# Altium project rtls.PrjPcb
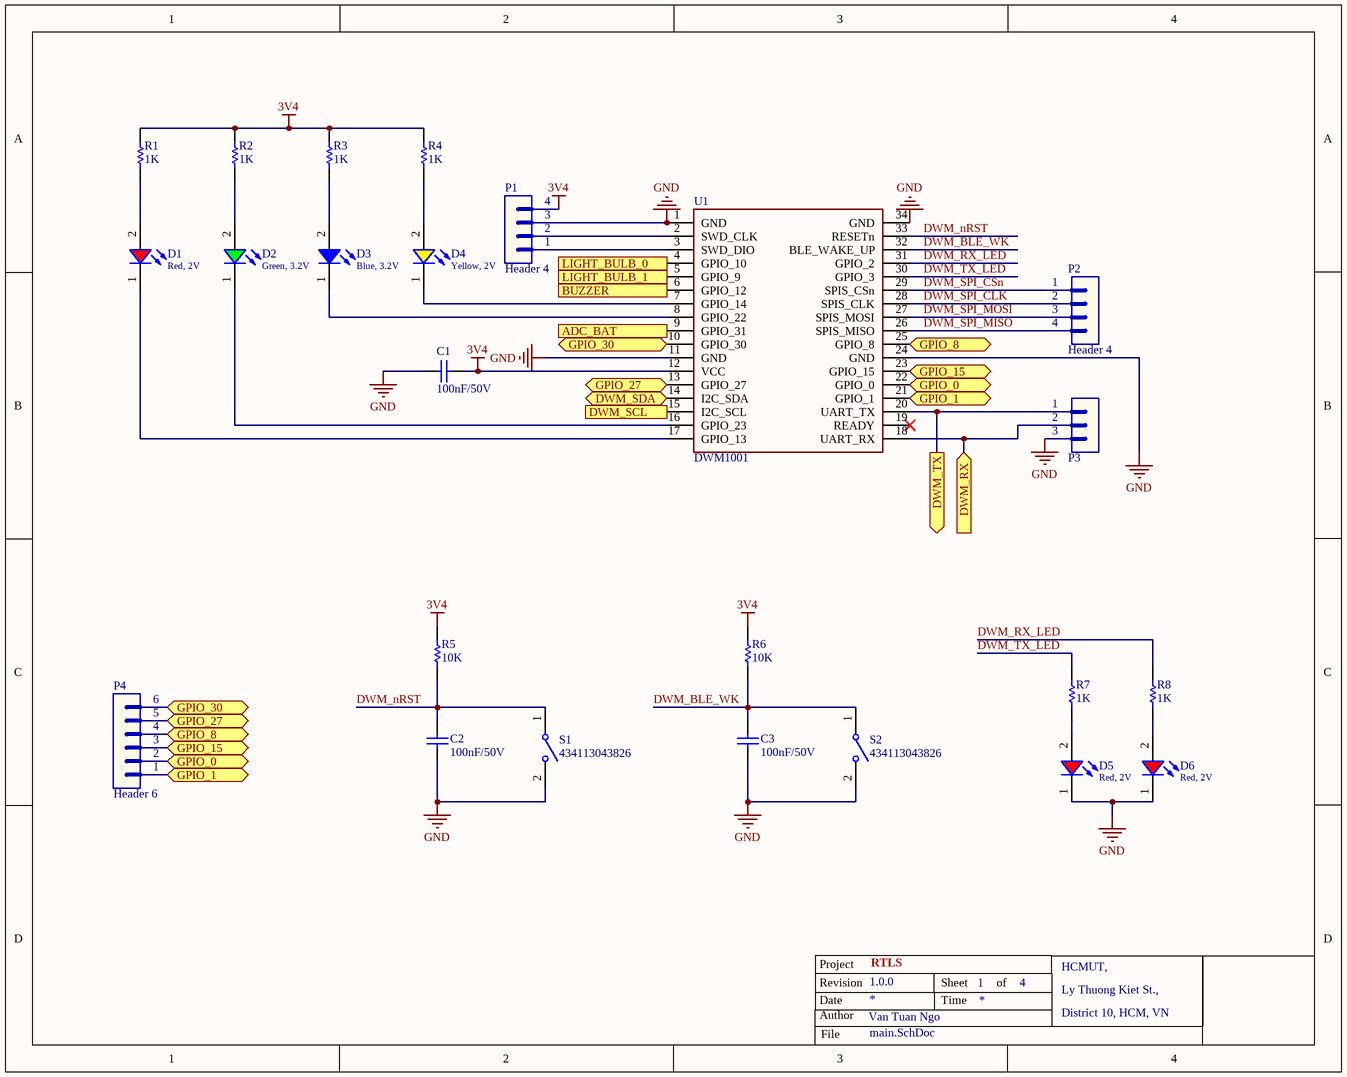
[diagram p0: main.SchDoc]
4 sheets, 76 parts. Net scope: flat (ports and power ports of the same name join across sheets).
Board file: rtls.PcbDoc
Sheets:
  main.SchDoc
  power_supply.SchDoc
  io_sensor.SchDoc
  serial.SchDoc

## Sheet main.SchDoc
size OrCAD A; DrawnBy: Van Tuan Ngo; Organization: PIF Club; Address1: HCMUT,; Address2: Ly Thuong Kiet St.,; Address3: District 10, HCM, VN; DocumentNumber: 1; Revision: 1.0.0; SheetNumber: 1; SheetTotal: 4; Project: RTLS

### Parts
C1  value 100nF/50V  [CAP-SM-0805]  (hidden comment: Cap-100nF-50V-0805)
C2  value 100nF/50V  [CAP-SM-0805]  (hidden comment: Cap-100nF-50V-0805)
C3  value 100nF/50V  [CAP-SM-0805]  (hidden comment: Cap-100nF-50V-0805)
D1  Red, 2V  [WL-SMCW_0805]
D2  Green, 3.2V  [WL-SMCW_0805]
D3  Blue, 3.2V  [WL-SMCW_0805]
D4  Yellow, 2V  [WL-SMCW_0805]
D5  Red, 2V  [WL-SMCW_0805]
D6  Red, 2V  [WL-SMCW_0805]
P1  Header 4  [JP4]
P2  Header 4  [JP4]
P3  Header 3  [JP3]  (value not drawn)
P4  Header 6  [JP6]
R1  value 1K  [RES-SM-0805]  (hidden comment: Res-1K-0805)
R2  value 1K  [RES-SM-0805]  (hidden comment: Res-1K-0805)
R3  value 1K  [RES-SM-0805]  (hidden comment: Res-1K-0805)
R4  value 1K  [RES-SM-0805]  (hidden comment: Res-1K-0805)
R5  value 10K  [RES-SM-0805]  (hidden comment: Res-10k-0805)
R6  value 10K  [RES-SM-0805]  (hidden comment: Res-10k-0805)
R7  value 1K  [RES-SM-0805]  (hidden comment: Res-1K-0805)
R8  value 1K  [RES-SM-0805]  (hidden comment: Res-1K-0805)
S1  434113043826  [434113043826]
S2  434113043826  [434113043826]
U1  DWM1001  [DWM1001]

### Ports
ADC_BAT (in), BUZZER (out), DWM_RX (in), DWM_SCL (out), DWM_SDA (bidir), DWM_TX (out), GPIO_0 (bidir), GPIO_1 (bidir), GPIO_8 (bidir), GPIO_15 (bidir), GPIO_27 (bidir), GPIO_30 (bidir), LIGHT_BULB_0 (out), LIGHT_BULB_1 (out)

### Nets
3V4: C1.2 P1.4 R1.1 R2.1 R3.1 R4.1 R5.2 R6.2 U1.12(VCC)
GND: C1.1 C2.1 C3.1 D5.1(K) D6.1(K) P1.3 P3.3 S1.2 S2.2 U1.1(GND) U1.11(GND) U1.24(GND) U1.34(GND)
DWM_BLE_WK: C3.2 R6.1 S2.1 U1.32(BLE_WAKE_UP)
DWM_nRST: C2.2 R5.1 S1.1 U1.33(RESETn)
DWM_RX_LED: R8.1 U1.31(GPIO_2)
DWM_SCL: U1.15(I2C_SCL) ; port DWM_SCL
DWM_SDA: U1.14(I2C_SDA) ; port DWM_SDA
DWM_SPI_CLK: P2.2 U1.28(SPIS_CLK)
DWM_SPI_CSn: P2.1 U1.29(SPIS_CSn)
DWM_SPI_MISO: P2.4 U1.26(SPIS_MISO)
DWM_SPI_MOSI: P2.3 U1.27(SPIS_MOSI)
DWM_TX_LED: R7.1 U1.30(GPIO_3)
NetD1_1: D1.1(K) U1.17(GPIO_13)
NetD1_2: D1.2(A) R1.2
NetD2_1: D2.1(K) U1.16(GPIO_23)
NetD2_2: D2.2(A) R2.2
NetD3_1: D3.1(K) U1.8(GPIO_22)
NetD3_2: D3.2(A) R3.2
NetD4_1: D4.1(K) U1.7(GPIO_14)
NetD4_2: D4.2(A) R4.2
NetD5_2: D5.2(A) R7.2
NetD6_2: D6.2(A) R8.2
NetP1_1: P1.1 U1.3(SWD_DIO)
NetP1_2: P1.2 U1.2(SWD_CLK)
NetP3_1: P3.1 U1.20(UART_TX) ; port DWM_TX
NetP3_2: P3.2 U1.18(UART_RX) ; port DWM_RX
NetP4_1: P4.1 U1.21(GPIO_1) ; port GPIO_1
NetP4_2: P4.2 U1.22(GPIO_0) ; port GPIO_0
NetP4_3: P4.3 U1.23(GPIO_15) ; port GPIO_15
NetP4_4: P4.4 U1.25(GPIO_8) ; port GPIO_8
NetP4_5: P4.5 U1.13(GPIO_27) ; port GPIO_27
NetP4_6: P4.6 U1.10(GPIO_30) ; port GPIO_30
NetQ1_1: U1.4(GPIO_10) ; port LIGHT_BULB_0
NetQ2_1: U1.5(GPIO_9) ; port LIGHT_BULB_1
NetR17_1: U1.9(GPIO_31) ; port ADC_BAT
NetR21_1: U1.6(GPIO_12) ; port BUZZER

Not connected (* = marked no-connect by the designer): U1 19(READY)*

### Notes on the sheet
- Project
- Revision
- Date
- Author
- Sheet
- Time
- of
- File

### Library data of the parts
C1-C3 = Cap-100nF-50V-0805: CAP CER 0.1UF 50V Y5V 0805; Manufacturer: Samsung Electro-Mechanics; Manufacturer Part Number: CL21F104ZBCNNNC; Local Supplier: thegioiic; Local Supplier Link: https://www.thegioiic.com/products/tu-gom-0805-100nf-0-1uf-50v; Supplier 1: Digikey; Supplier 1 Part Number: 1276-1007-1-ND; Supplier 1 Link: https://www.digikey.com/product-detail/en/samsung-electro-mechanics/CL21F104ZBCNNNC/1276-1007-1-ND/3889093
D1 D5 D6 = 150080RS75000: WL-SMCW SMT Mono-color Chip LED Waterclear, size 0805, Red, 2V, 140deg; Chip Technology: AlInGaP; Dominant Wavelength typ.: 625nm; Luminous Intensity typ.: 150mcd; Peak Wavelength typ.: 630nm; Viewing Angle: 140deg; ComponentLink1Description: Manufacturer; ComponentLink1URL: http://www.we-online.de; ComponentLink2URL: https://www.we-online.com/catalog/datasheet/150080RS75000.pdf; ComponentLink2Description: Datasheet; Forward Voltage typ.: 2V; Emitting Color: Red; Mounting Technology: SMT; Operating Temperature: -40 to +85degC; Published Date: December 2019; Part Number: 150080RS75000; Packaging: Tape and Reel; Size: 0805; Publisher: Wurth Elektronik
D2 = 150080GS75000: WL-SMCW SMT Mono-color Chip LED Waterclear, size 0805, Green, 3.2V, 140deg; Chip Technology: InGaN; Dominant Wavelength typ.: 525nm; Luminous Intensity typ.: 450mcd; Peak Wavelength typ.: 515nm; Viewing Angle: 140deg; ComponentLink1Description: Manufacturer; ComponentLink1URL: http://www.we-online.de; ComponentLink2URL: https://www.we-online.com/catalog/datasheet/150080GS75000.pdf; ComponentLink2Description: Datasheet; Forward Voltage typ.: 3.2V; Emitting Color: Green; Mounting Technology: SMT; Operating Temperature: -40 to +85degC; Published Date: December 2019; Part Number: 150080GS75000; Packaging: Tape and Reel; Size: 0805; Publisher: Wurth Elektronik
D3 = 150080BS75000: WL-SMCW SMT Mono-color Chip LED Waterclear, size 0805, Blue, 3.2V, 140deg; Chip Technology: InGaN; Dominant Wavelength typ.: 470nm; Luminous Intensity typ.: 145mcd; Peak Wavelength typ.: 465nm; Viewing Angle: 140deg; ComponentLink1Description: Manufacturer; ComponentLink1URL: http://www.we-online.de; ComponentLink2URL: https://www.we-online.com/catalog/datasheet/150080BS75000.pdf; ComponentLink2Description: Datasheet; Forward Voltage typ.: 3.2V; Emitting Color: Blue; Mounting Technology: SMT; Operating Temperature: -40 to +85degC; Published Date: December 2019; Part Number: 150080BS75000; Packaging: Tape and Reel; Size: 0805; Publisher: Wurth Elektronik
D4 = 150080YS75000: WL-SMCW SMT Mono-color Chip LED Waterclear, size 0805, Yellow, 2V, 140deg; Chip Technology: AlInGaP; Dominant Wavelength typ.: 590nm; Luminous Intensity typ.: 120mcd; Peak Wavelength typ.: 595nm; Viewing Angle: 140deg; ComponentLink1Description: Manufacturer; ComponentLink1URL: http://www.we-online.de; ComponentLink2URL: https://www.we-online.com/catalog/datasheet/150080YS75000.pdf; ComponentLink2Description: Datasheet; Forward Voltage typ.: 2V; Emitting Color: Yellow; Mounting Technology: SMT; Operating Temperature: -40 to +85degC; Published Date: December 2019; Part Number: 150080YS75000; Packaging: Tape and Reel; Size: 0805; Publisher: Wurth Elektronik
P1 P2 = Header 4: Header, 4-Pin; LatestRevisionDate: 17-Jul-2002; LatestRevisionNote: Re-released for DXP Platform.; Publisher: Altium Limited; Local Supplier: thegioiic; Local Supplier Part Number: x; Local Supplier Link: https://www.thegioiic.com/products/hang-rao-duc-don-2-54mm-40-chan-1-hang-cao-11-4mm-xuyen-lo
P3 = Header 3: Header, 3-Pin; LatestRevisionDate: 17-Jul-2002; LatestRevisionNote: Re-released for DXP Platform.; Publisher: Altium Limited; Local Supplier: thegioiic; Local Supplier Part Number: x; Local Supplier Link: https://www.thegioiic.com/products/hang-rao-duc-don-2-54mm-40-chan-1-hang-cao-11-4mm-xuyen-lo
P4 = Header 6: Header, 6-Pin; LatestRevisionDate: 17-Jul-2002; LatestRevisionNote: Re-released for DXP Platform.; Publisher: Altium Limited; Local Supplier Link: https://www.thegioiic.com/products/hang-rao-duc-don-2-54mm-40-chan-1-hang-cao-11-4mm-xuyen-lo; Local Supplier: thegioiic; Local Supplier Part Number: x
R1-R4 R7 R8 = Res-1K-0805: RES 1K OHM 1% 1/4W 0805; Manufacturer: Stackpole Electronics Inc; Manufacturer Part Number: RNCP0805FTD1K00; Local Supplier: thegioiic; Local Supplier Link: https://www.thegioiic.com/products/dien-tro-1-kohm-0805-5; Supplier 1: Digikey; Supplier 1 Link: https://www.digikey.com/product-detail/en/stackpole-electronics-inc/RNCP0805FTD1K00/RNCP0805FTD1K00CT-ND/2240568; Supplier 1 Part Number: RNCP0805FTD1K00CT-ND
R5 R6 = Res-10k-0805: RES 10K OHM 1% 1/4W 0805; Manufacturer: Stackpole Electronics Inc; Manufacturer Part Number: RNCP0805FTD10K0; Local Supplier: thegioiic; Local Supplier Link: https://www.thegioiic.com/products/dien-tro-10-kohm-0805-5; Supplier 1: Digikey; Supplier 1 Link: https://www.digikey.com/product-detail/en/stackpole-electronics-inc/RNCP0805FTD10K0/RNCP0805FTD10K0CT-ND/2240601; Supplier 1 Part Number: RNCP0805FTD10K0CT-ND
S1 S2 = 434113043826: WS-TASV J-Bend SMT Tact Switch 6x3.5mm, height 4.3mm, 260gf; Rated Voltage: 12VDC; Rated Current: 50mA; Washable: No; ComponentLink1Description: Manufacturer; ComponentLink1URL: http://www.we-online.de; ComponentLink2Description: Datasheet; ComponentLink2URL: https://katalog.we-online.com/em/datasheet/434113043826.pdf; Operating Temperature: -40 to +85degC; Part Number: 434113043826; Published Date: September 2019; Contact Material: Stainless Steel; Height: 4.3mm; Mounting Technology: SMT; Contact Plating: Silver; Operation Force: 260gf; Packaging: Tape and Reel; Terminal Material: Copper Alloy; Publisher: Wurth Elektronik; Terminal Plating: Silver; Local Supplier: thegioiic; Local Supplier Link: https://www.thegioiic.com/products/nut-nhan-3-5x6mm-cao-5mm-2-chan-smd-dau-trang; Local Supplier Part Number: x
U1 = DWM1001: Local Supplier: x; Local Supplier Part Number: x; Local Supplier Link: x

## Sheet power_supply.SchDoc
size OrCAD A; DrawnBy: Van Tuan Ngo; Organization: PIF Club; Address1: HCMUT,; Address2: Ly Thuong Kiet St.,; Address3: District 10, HCM, VN; DocumentNumber: 2; Revision: 1.0.0; SheetNumber: 2; SheetTotal: 4; Project: RTLS
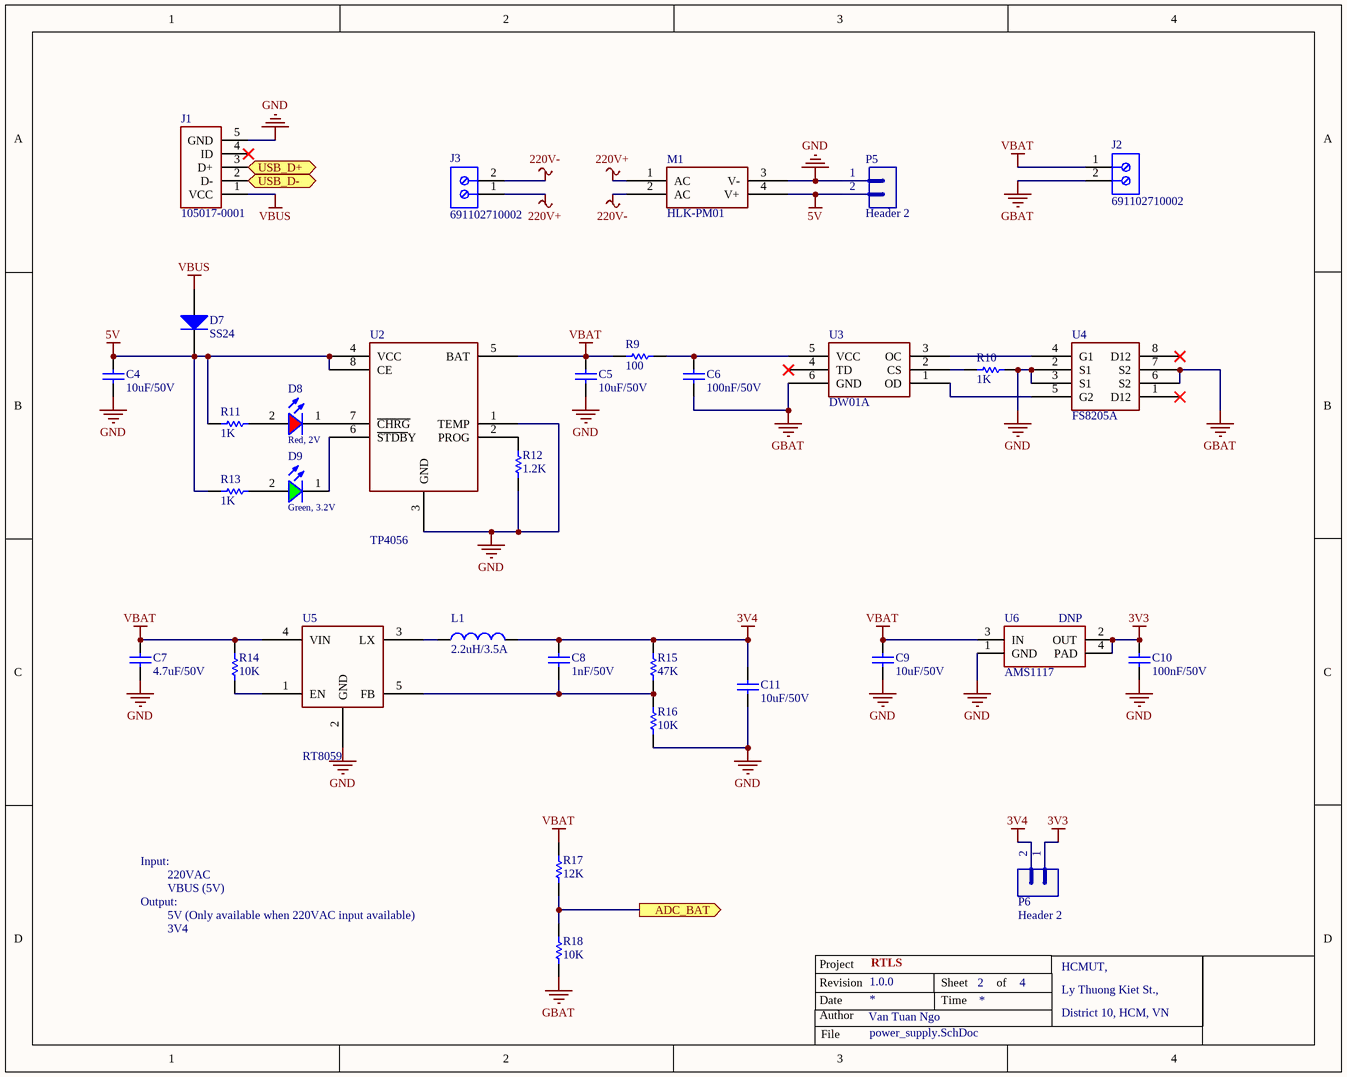
[diagram p1: power_supply.SchDoc]

### Parts
C4  value 10uF/50V  [CAP-SM-0805]  (hidden comment: Cap-10uF-50V-0805)
C5  value 10uF/50V  [CAP-SM-0805]  (hidden comment: Cap-10uF-50V-0805)
C6  value 100nF/50V  [CAP-SM-0805]  (hidden comment: Cap-100nF-50V-0805)
C7  value 4.7uF/50V  [CAP-SM-0805]  (hidden comment: Cap-4.7uF-50V-0805)
C8  value 1nF/50V  [CAP-SM-0805]  (hidden comment: Cap-22pF-50V-0805)
C9  value 10uF/50V  [CAP-SM-0805]  (hidden comment: Cap-10uF-50V-0805)
C10  value 100nF/50V  [CAP-SM-0805]  (hidden comment: Cap-100nF-50V-0805)
C11  value 10uF/50V  [CAP-SM-0805]  (hidden comment: Cap-10uF-50V-0805)
D7  SS24  [SS24]
D8  Red, 2V  [WL-SMCW_0805]
D9  Green, 3.2V  [WL-SMCW_0805]
J1  105017-0001  [Micro-USB-Female]
J2  691102710002  [691102710002]
J3  691102710002  [691102710002]
L1  2.2uH/3.5A  [CD53]
M1  HLK-PM01  [HLK-PM01]
P5  Header 2  [JP2]
P6  Header 2  [JP2]
R9  value 100  [RES-SM-0805]  (hidden comment: Res-100-0805)
R10  value 1K  [RES-SM-0805]  (hidden comment: Res-1K-0805)
R11  value 1K  [RES-SM-0805]  (hidden comment: Res-1K-0805)
R12  value 1.2K  [RES-SM-0805]  (hidden comment: Res-1.2K-0805)
R13  value 1K  [RES-SM-0805]  (hidden comment: Res-1K-0805)
R14  value 10K  [RES-SM-0805]  (hidden comment: Res-10k-0805)
R15  value 47K  [RES-SM-0805]  (hidden comment: Res-47K-0805)
R16  value 10K  [RES-SM-0805]  (hidden comment: Res-10k-0805)
R17  value 12K  [RES-SM-0805]  (hidden comment: Res-12K-0805)
R18  value 10K  [RES-SM-0805]  (hidden comment: Res-10k-0805)
U2  TP4056  [SOP8]
U3  DW01A  [SOT-23-6]
U4  FS8205A  [TSSOP8]
U5  RT8059  [SOT-23-5]
U6  AMS1117  [SOT223]

### Ports
ADC_BAT (out), USB_D+ (bidir), USB_D- (bidir)

### Nets
3V3: C10.2 P6.1 U6.2(OUT) U6.4(PAD)
3V4: C8.2 C11.2 L1.2 P6.2 R15.2
5V: C4.2 D7.1(K) M1.4(V+) P5.2 R11.1 R13.1 U2.4(VCC) U2.8(CE)
220V+: J3.1 M1.1(AC)
220V-: J3.2 M1.2(AC)
GBAT: C6.1 J2.2 R18.1 U3.6(GND) U4.6(S2) U4.7(S2)
GND: C4.1 C5.1 C7.1 C9.1 C10.1 C11.1 J1.5(GND) M1.3(V-) P5.1 R10.2 R12.1 R16.1 U2.1(TEMP) U2.3(GND) U4.2(S1) U4.3(S1) U5.2(GND) U6.1(GND)
VBAT: C5.2 C7.2 C9.2 J2.1 R9.1 R14.2 R17.2 U2.5(BAT) U5.4(VIN) U6.3(IN)
VBUS: D7.2(A) J1.1(VCC)
NetC6_2: C6.2 R9.2 U3.5(VCC)
NetC8_1: C8.1 R15.1 R16.2 U5.5(FB)
NetD8_1: D8.1(K) U2.7(~{CHRG})
NetD8_2: D8.2(A) R11.2
NetD9_1: D9.1(K) U2.6(~{STDB}Y)
NetD9_2: D9.2(A) R13.2
NetJ1_2: J1.2(D-) ; port USB_D-
NetJ1_3: J1.3(D+) ; port USB_D+
NetL1_1: L1.1 U5.3(LX)
NetR10_1: R10.1 U3.2(CS)
NetR12_2: R12.2 U2.2(PROG)
NetR14_1: R14.1 U5.1(EN)
NetR17_1: R17.1 R18.2 ; port ADC_BAT
NetU3_1: U3.1(OD) U4.5(G2)
NetU3_3: U3.3(OC) U4.4(G1)

Not connected (* = marked no-connect by the designer): J1 4(ID)*; U3 4(TD)*; U4 1(D12)* 8(D12)*

### Notes on the sheet
- (near U6) DNP
- Input:
- 220VAC
- VBUS (5V)
- Output:
- 3V4
- 5V (Only available when 220VAC input available)
- Project
- Revision
- Date
- Author
- Sheet
- Time
- of
- File

### Library data of the parts
C4 C5 C9 C11 = Cap-10uF-50V-0805: CAP CER 10UF 50V X5R 0805; Manufacturer: Yageo; Manufacturer Part Number: CC0805KKX5R9BB106; Local Supplier: thegioiic; Local Supplier Link: https://www.thegioiic.com/products/tu-gom-0805-10uf-50v; Supplier 1: Digikey; Supplier 1 Link: https://www.digikey.com/product-detail/en/yageo/CC0805KKX5R9BB106/311-3499-2-ND/7164383; Supplier 1 Part Number: 311-3499-2-ND
C6 C10 = Cap-100nF-50V-0805: as C1 on sheet main; Local Supplier: thegioiic; Local Supplier Link: https://www.thegioiic.com/products/tu-gom-0805-100nf-0-1uf-50v; Supplier 1: Digikey; Supplier 1 Part Number: 1276-1007-1-ND; Supplier 1 Link: https://www.digikey.com/product-detail/en/samsung-electro-mechanics/CL21F104ZBCNNNC/1276-1007-1-ND/3889093
C7 = Cap-4.7uF-50V-0805: CAP CER 4.7UF 50V X5R 0805; Manufacturer: Murata Electronics; Manufacturer Part Number: GRM21BR61H475KE51L; Local Supplier: thegioiic; Local Supplier Link: https://thegioiic.com/products/tu-4-7uf-50v-0805-cap; Supplier 1: Digikey; Supplier 1 Link: https://www.digikey.com/product-detail/en/murata-electronics/GRM21BR61H475KE51L/490-10751-1-ND/5251349; Supplier 1 Part Number: 490-10751-1-ND
C8 = Cap-22pF-50V-0805: CAP CER 22PF 100V X7R 0805; Manufacturer: Johanson Dielectrics Inc.; Manufacturer Part Number: 101X15W102MV4E; Local Supplier: thegioiic; Local Supplier Link: https://thegioiic.com/products/tu-1nf-50v-0805; Supplier 1: Digikey; Supplier 1 Link: https://www.digikey.com/product-detail/en/johanson-dielectrics-inc/101X15W102MV4E/709-1335-1-ND/2327235; Supplier 1 Part Number: 709-1335-1-ND
D7 = Diode-SS24: DIODE SCHOTTKY 40V 2A DO214AA; Manufacturer: ON Semiconductor; Local Supplier: thegioiic; Local Supplier Link: https://thegioiic.com/products/ss24-smb; Supplier 1: Digikey; Supplier 1 Part Number: SS24FSCT-ND; Manufacturer Part Number: SS24; Supplier 1 Link: https://www.digikey.com/product-detail/en/on-semiconductor/SS24/SS24FSCT-ND/1626273
D8 = 150080RS75000: as D1 on sheet main; Viewing Angle: 140deg; ComponentLink1Description: Manufacturer; ComponentLink1URL: http://www.we-online.de; ComponentLink2URL: https://www.we-online.com/catalog/datasheet/150080RS75000.pdf; ComponentLink2Description: Datasheet; Forward Voltage typ.: 2V; Emitting Color: Red; Mounting Technology: SMT; Operating Temperature: -40 to +85degC; Published Date: December 2019; Part Number: 150080RS75000; Packaging: Tape and Reel; Size: 0805; Publisher: Wurth Elektronik
D9 = 150080GS75000: as D2 on sheet main; Viewing Angle: 140deg; ComponentLink1Description: Manufacturer; ComponentLink1URL: http://www.we-online.de; ComponentLink2URL: https://www.we-online.com/catalog/datasheet/150080GS75000.pdf; ComponentLink2Description: Datasheet; Forward Voltage typ.: 3.2V; Emitting Color: Green; Mounting Technology: SMT; Operating Temperature: -40 to +85degC; Published Date: December 2019; Part Number: 150080GS75000; Packaging: Tape and Reel; Size: 0805; Publisher: Wurth Elektronik
J1 = Micro-USB-Female: CONN RCPT USB2.0 MICRO B SMD R/A; Vendor: Molex Connector Corporation; Built_By: EMA_Cory; SourceLibrary: Molex_2020-05-26; Datasheet: https://www.molex.com/pdm_docs/sd/1050170001_sd.pdf; Manufacturer_Part_Number: 105017-0001; Copyright: Copyright (C) 2018 Accelerated Designs. All rights reserved; RefDes: RefDes; Type: DEV; Local Supplier: thegioiic; Local Supplier Part Number: x; Local Supplier Link: https://www.thegioiic.com/products/cong-usb-micro-b-2-0-dau-cai-5-chan-smd-v1
J2 J3 = 691102710002: WR-TBL Serie 102 Horizontal Entry Modular, Pressure Clamp, pitch 5mm, 2p; Compliance: Lead free / RoHS; Modularity: Yes; PCB/Cable/Panel: PCB; Pin Number: 2; Rated Current [UL]: 15A; Working Voltage [UL]: 250VAC; ComponentLink1Description: Manufacturer; ComponentLink1URL: http://www.we-online.de; ComponentLink2URL: https://katalog.we-online.de/em/datasheet/691102710002.pdf; ComponentLink2Description: Datasheet; Mounting Technology: THT; Part Number: 691102710002; Packaging: Box; Operating Temperature: -40 to +105degC; Pitch: 5mm; Published Date: October 2019; Type: Horizontal; Publisher: Wurth Elektronik; Application: Pressure Clamp
L1 = ind-2.2uH-3.5A-CD53
P5 P6 = Header 2: Header, 2-Pin; LatestRevisionDate: 17-Jul-2002; LatestRevisionNote: Re-released for DXP Platform.; Publisher: Altium Limited; Local Supplier: thegioiic; Local Supplier Part Number: x; Local Supplier Link: https://www.thegioiic.com/products/hang-rao-duc-don-2-54mm-40-chan-1-hang-cao-11-4mm-xuyen-lo
R9 = Res-100-0805: RES 100 OHM 0.1% 1/5W 0805; Manufacturer: Vishay Thin Film; Manufacturer Part Number: PTN0805E10R0BST1; Local Supplier: thegioiic; Local Supplier Link: https://thegioiic.com/products/dien-tro-10-ohm-0805-5; Supplier 1: Digikey; Supplier 1 Link: https://www.digikey.com/product-detail/en/vishay-thin-film/PTN0805E10R0BST1/764-1471-1-ND/7103255; Supplier 1 Part Number: 764-1471-1-ND
R10 R11 R13 = Res-1K-0805: as R1 on sheet main; Local Supplier: thegioiic; Local Supplier Link: https://www.thegioiic.com/products/dien-tro-1-kohm-0805-5; Supplier 1: Digikey; Supplier 1 Link: https://www.digikey.com/product-detail/en/stackpole-electronics-inc/RNCP0805FTD1K00/RNCP0805FTD1K00CT-ND/2240568; Supplier 1 Part Number: RNCP0805FTD1K00CT-ND
R12 = Res-1.2K-0805: RES SMD 1.2K OHM 1% 1/8W 0805; Manufacturer: TE Connectivity Passive Product; Manufacturer Part Number: CRG0805F1K2; Local Supplier: thegioiic; Local Supplier Link: https://thegioiic.com/products/dien-tro-1-2k-ohm-0805-5; Supplier 1: Digikey; Supplier 1 Link: https://www.digikey.com/product-detail/en/te-connectivity-passive-product/CRG0805F1K2/A126346CT-ND/7603401; Supplier 1 Part Number: A126346CT-ND
R14 R16 R18 = Res-10k-0805: as R5 on sheet main; Local Supplier: thegioiic; Local Supplier Link: https://www.thegioiic.com/products/dien-tro-10-kohm-0805-5; Supplier 1: Digikey; Supplier 1 Link: https://www.digikey.com/product-detail/en/stackpole-electronics-inc/RNCP0805FTD10K0/RNCP0805FTD10K0CT-ND/2240601; Supplier 1 Part Number: RNCP0805FTD10K0CT-ND
R15 = Res-47K-0805: RES SMD 47K OHM 1% 1/8W 0805; Manufacturer: Yageo; Manufacturer Part Number: RC0805FR-0747KL; Local Supplier: thegioiic; Local Supplier Link: https://thegioiic.com/products/dien-tro-47k-ohm-0603-5; Supplier 1: Digikey; Supplier 1 Part Number: 311-47.0KCRCT-ND; Supplier 1 Link: https://www.digikey.com/product-detail/en/yageo/RC0805FR-0747KL/311-47.0KCRCT-ND/730920
R17 = Res-12K-0805: RES 12 KOHM JUMPER 0805; Manufacturer: Vishay Thin Film; Manufacturer Part Number: PAT0805E3121BST1; Local Supplier: icdayroi; Local Supplier Link: https://icdayroi.com/dien-tro-12k-0805-1-goi-50-con; Supplier 1: Digikey; Supplier 1 Link: https://www.digikey.com/product-detail/en/vishay-thin-film/PAT0805E3121BST1/PAT0805E3121BST1-ND/2281536; Supplier 1 Part Number: PAT0805E3121BST1-ND
U2 = TP4056: Linear charger for single cell / lithium-ion batteries
U3 = DW01A: Battery protection IC
U5 = RT8059: High efficiency PWM step-down DC/DC converter
U6 = AMS1117: Available in 1.8V, 2.5V, 2.85V, 3.3V, 5V, and  Adjustable Versions; Local Supplier: thegioiic; Local Supplier Part Number: *; Local Supplier Link: https://www.thegioiic.com/products/ams1117-3-3v

## Sheet io_sensor.SchDoc
size OrCAD A; DrawnBy: Van Tuan Ngo; Organization: PIF Club; Address1: HCMUT,; Address2: Ly Thuong Kiet St.,; Address3: District 10, HCM, VN; DocumentNumber: 3; Revision: 1.0.0; SheetNumber: 3; SheetTotal: 4; Project: RTLS
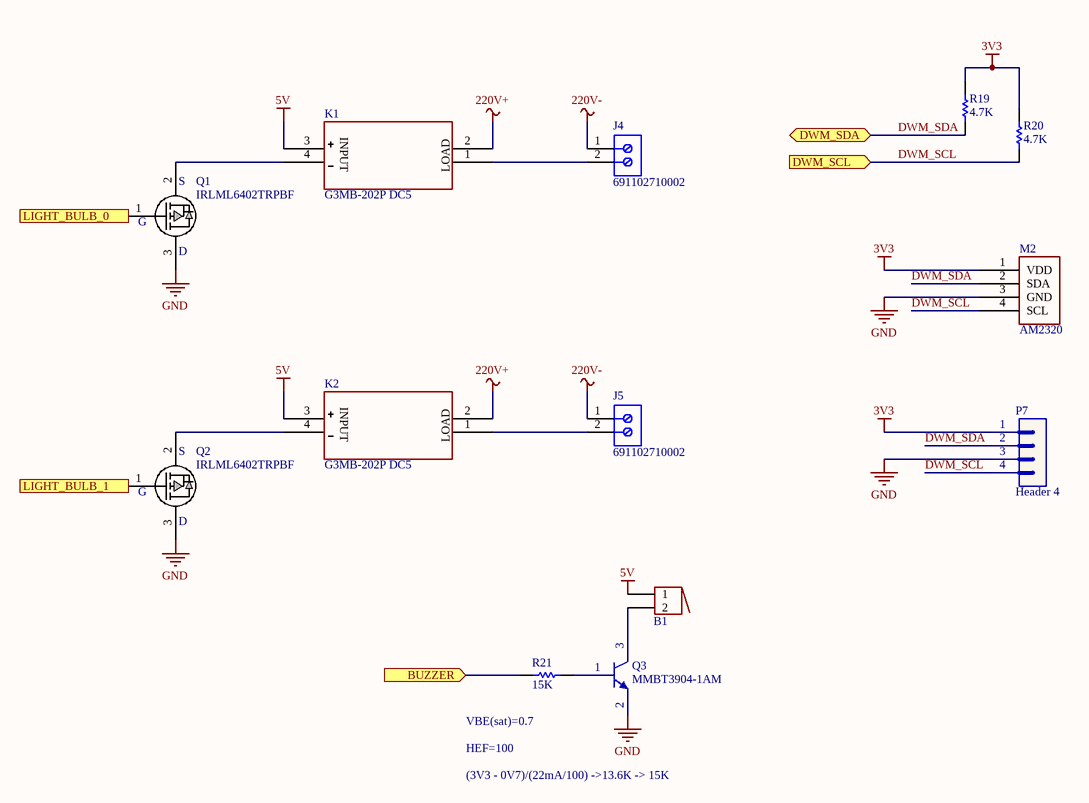
[diagram p2: io_sensor.SchDoc]

### Parts
B1  Buzzer  [BUZZER]  (value not drawn)
J4  691102710002  [691102710002]
J5  691102710002  [691102710002]
K1  G3MB-202P DC5  [G3MB]
K2  G3MB-202P DC5  [G3MB]
M2  AM2320  [AM2320]
P7  Header 4  [JP4]
Q1  IRLML6402TRPBF  [SOT23_NEX]
Q2  IRLML6402TRPBF  [SOT23_NEX]
Q3  MMBT3904-1AM  [SOT23_NEX]
R19  value 4.7K  [RES-SM-0805]  (hidden comment: Res-4.7K-0805)
R20  value 4.7K  [RES-SM-0805]  (hidden comment: Res-4.7K-0805)
R21  value 15K  [RES-SM-0805]  (hidden comment: Res-15K-0805)

### Ports
BUZZER (in), DWM_SCL (in), DWM_SDA (bidir), LIGHT_BULB_0 (in), LIGHT_BULB_1 (in)

### Nets
3V3: M2.1(VDD) P7.1 R19.2 R20.2
5V: B1.1 K1.3 K2.3
220V+: K1.2 K2.2
220V-: J4.1 J5.1
GND: M2.3(GND) P7.3 Q1.3(D) Q2.3(D) Q3.2(E)
DWM_SCL: M2.4(SCL) P7.4 R20.1 ; port DWM_SCL
DWM_SDA: M2.2(SDA) P7.2 R19.1 ; port DWM_SDA
NetB1_2: B1.2 Q3.3(C)
NetJ4_2: J4.2 K1.1
NetJ5_2: J5.2 K2.1
NetK1_4: K1.4 Q1.2(S)
NetK2_4: K2.4 Q2.2(S)
NetQ1_1: Q1.1(G) ; port LIGHT_BULB_0
NetQ2_1: Q2.1(G) ; port LIGHT_BULB_1
NetQ3_1: Q3.1(B) R21.2
NetR21_1: R21.1 ; port BUZZER

### Notes on the sheet
- (near R21) VBE(sat)=0.7
- HEF=100
- (3V3 - 0V7)/(22mA/100) ->13.6K -> 15K
- Project
- Revision
- Date
- Author
- Sheet
- Time
- of
- File
- (in symbol G3MB-202P DC5) INPUT; LOAD

### Library data of the parts
J4 J5 = 691102710002: as J2 on sheet power_supply; ComponentLink1Description: Manufacturer; ComponentLink1URL: http://www.we-online.de; ComponentLink2URL: https://katalog.we-online.de/em/datasheet/691102710002.pdf; ComponentLink2Description: Datasheet; Mounting Technology: THT; Part Number: 691102710002; Packaging: Box; Operating Temperature: -40 to +105degC; Pitch: 5mm; Published Date: October 2019; Type: Horizontal; Publisher: Wurth Elektronik; Application: Pressure Clamp
K1 K2 = G3MB-202P DC5: 5VDC-220VAC Solid State Relay; Vendor: Omron; Built_By: EMA_Cory; SourceLibrary: Omron_2020-03-27_1; Datasheet: https://media.digikey.com/pdf/Data%20Sheets/Omron%20PDFs/G3MB.pdf; Manufacturer_Part_Number: G3MB-202P DC5; Copyright: Copyright (C) 2018 Accelerated Designs. All rights reserved; RefDes: RefDes; Type: DEV
P7 = Header 4: Header, 4-Pin; LatestRevisionDate: 17-Jul-2002; LatestRevisionNote: Re-released for DXP Platform.; Publisher: Altium Limited; Local Supplier: thegioiic; Local Supplier Part Number: x; Local Supplier Link: https://www.thegioiic.com/products/hang-rao-duc-don-2-54mm-40-chan-1-hang-cao-11-4mm-xuyen-lo
Q1 Q2 = IRLML6402TRPBF: P-Channel 20V 3.7A (Ta) 1.3W (Ta) Surface Mount Micro3™/SOT-23; Local Supplier: thegioiic; Local Supplier Link: https://www.thegioiic.com/products/irlml6402trpbf; Local Supplier Part Number: *
R19 R20 = Res-4.7K-0805: RES SMD 4.7K OHM 5% 1/8W 0805; Manufacturer: Yageo; Manufacturer Part Number: RC0805JR-074K7L; Local Supplier: thegioiic; Local Supplier Link: https://www.thegioiic.com/products/dien-tro-4-7-kohm-0805-5; Supplier 1: Digikey; Supplier 1 Link: https://www.digikey.com/product-detail/en/yageo/RC0805JR-074K7L/311-4.7KARCT-ND/731274; Supplier 1 Part Number: 311-4.7KARCT-ND
R21 = Res-15K-0805: RES 15K OHM 1% 1/4W 0805; Manufacturer: TE Connectivity Passive Product; Manufacturer Part Number: CRGCQ0805F15K; Local Supplier: thegioiic; Local Supplier Link: https://www.thegioiic.com/products/dien-tro-15-kohm-0805-5; Supplier 1: Digikey; Supplier 1 Part Number: A129763CT-ND; Supplier 1 Link: https://www.digikey.com/product-detail/en/te-connectivity-passive-product/CRGCQ0805F15K/A129763CT-ND/8577595
B1 = Buzzer: Local Supplier: thegioiic; Local Supplier Link: https://www.thegioiic.com/products/1209-dip-buzzer-12x9mm; Local Supplier Part Number: 1209 DIP Buzzer 12x9mm
Q3 = MMBT3904-1AM: Local Supplier: thegioiic; Local Supplier Link: https://www.thegioiic.com/products/mmbt3904-1am; Local Supplier Part Number: *

## Sheet serial.SchDoc
size OrCAD A; DrawnBy: Van Tuan Ngo; Organization: PIF Club; Address1: HCMUT,; Address2: Ly Thuong Kiet St.,; Address3: District 10, HCM, VN; DocumentNumber: 4; Revision: 1.0.0; SheetNumber: 4; SheetTotal: 4; Project: RTLS
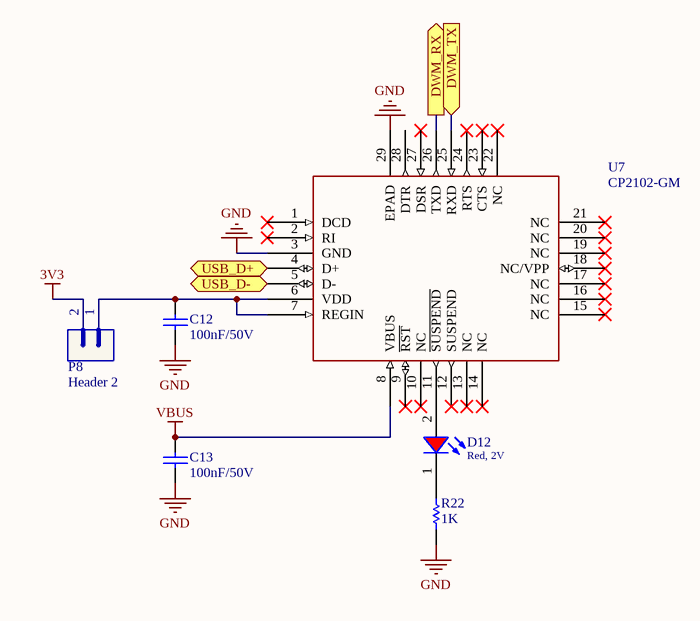
[diagram p3: serial.SchDoc]

### Parts
C12  value 100nF/50V  [CAP-SM-0805]  (hidden comment: Cap-100nF-50V-0805)
C13  value 100nF/50V  [CAP-SM-0805]  (hidden comment: Cap-100nF-50V-0805)
D12  Red, 2V  [WL-SMCW_0805]
P8  Header 2  [JP2]
R22  value 1K  [RES-SM-0805]  (hidden comment: Res-1K-0805)
U7  CP2102-GM  [QFN28_5X5_SIL]

### Ports
DWM_RX (out), DWM_TX (in), USB_D+ (bidir), USB_D- (bidir)

### Nets
3V3: P8.2
GND: C12.1 C13.1 R22.1 U7.3(GND) U7.29(EPAD)
VBUS: C13.2 U7.8(VBUS)
NetC12_2: C12.2 P8.1 U7.6(VDD) U7.7(REGIN)
NetD12_1: D12.1(K) R22.2
NetD12_2: D12.2(A) U7.11(~{SUSPEND})
NetJ1_2: U7.5(D-) ; port USB_D-
NetJ1_3: U7.4(D+) ; port USB_D+
NetP3_1: U7.25(RXD) ; port DWM_TX
NetP3_2: U7.26(TXD) ; port DWM_RX

Not connected (* = marked no-connect by the designer): U7 1(DCD)* 2(RI)* 9(~{RST})* 10(NC)* 12(SUSPEND)* 13(NC)* 14(NC)* 15(NC)* 16(NC)* 17(NC)* 18(NC/VPP)* 19(NC)* 20(NC)* 21(NC)* 22(NC)* 23(CTS)* 24(RTS)* 27(DSR)* 28(DTR)

### Notes on the sheet
- Project
- Revision
- Date
- Author
- Sheet
- Time
- of
- File

### Library data of the parts
C12 C13 = Cap-100nF-50V-0805: as C1 on sheet main; Local Supplier: thegioiic; Local Supplier Link: https://thegioiic.com/products/tu-100nf-0-1uf-50v-0805; Supplier 1: Digikey; Supplier 1 Part Number: 1276-1007-1-ND; Supplier 1 Link: https://www.digikey.com/product-detail/en/samsung-electro-mechanics/CL21F104ZBCNNNC/1276-1007-1-ND/3889093
D12 = 150080RS75000: as D1 on sheet main; Viewing Angle: 140deg; ComponentLink1Description: Manufacturer; ComponentLink1URL: http://www.we-online.de; ComponentLink2URL: https://www.we-online.com/catalog/datasheet/150080RS75000.pdf; ComponentLink2Description: Datasheet; Forward Voltage typ.: 2V; Emitting Color: Red; Mounting Technology: SMT; Operating Temperature: -40 to +85degC; Published Date: December 2019; Part Number: 150080RS75000; Packaging: Tape and Reel; Size: 0805; Publisher: Wurth Elektronik
P8 = Header 2: Header, 2-Pin; LatestRevisionDate: 17-Jul-2002; LatestRevisionNote: Re-released for DXP Platform.; Publisher: Altium Limited; Local Supplier: thegioiic; Local Supplier Part Number: x; Local Supplier Link: https://www.thegioiic.com/products/hang-rao-duc-don-2-54mm-40-chan-1-hang-cao-11-4mm-xuyen-lo
R22 = Res-1K-0805: as R1 on sheet main; Local Supplier: thegioiic; Local Supplier Link: https://www.thegioiic.com/products/dien-tro-1-kohm-0805-5; Supplier 1: Digikey; Supplier 1 Link: https://www.digikey.com/product-detail/en/stackpole-electronics-inc/RNCP0805FTD1K00/RNCP0805FTD1K00CT-ND/2240568; Supplier 1 Part Number: RNCP0805FTD1K00CT-ND
U7 = CP2102-GM: Vendor: Silicon Labs; Built_By: EMA_UL_Team; SourceLibrary: Silicon_Labs_2015-03-23; Manufacturer_Part_Number: CP2102-GM; Copyright: Copyright (C) 2018 Accelerated Designs. All rights reserved; RefDes: RefDes; Type: DEV; Local Supplier: thegioiic; Local Supplier Part Number: *; Local Supplier Link: https://www.thegioiic.com/products/cp2102

## Nets that join several sheets
3V3: power_supply (C10.2 P6.1 U6.2 U6.4), io_sensor (M2.1 P7.1 R19.2 R20.2), serial (P8.2)
3V4: main (9 pins), power_supply (5 pins)
5V: power_supply (8 pins), io_sensor (B1.1 K1.3 K2.3)
220V+: power_supply (J3.1 M1.1), io_sensor (K1.2 K2.2)
220V-: power_supply (J3.2 M1.2), io_sensor (J4.1 J5.1)
GND: main (13 pins), power_supply (18 pins), io_sensor (5 pins), serial (5 pins)
VBUS: power_supply (D7.2 J1.1), serial (C13.2 U7.8)
DWM_SCL: main (U1.15), io_sensor (M2.4 P7.4 R20.1)
DWM_SDA: main (U1.14), io_sensor (M2.2 P7.2 R19.1)
NetJ1_2: power_supply (J1.2), serial (U7.5)
NetJ1_3: power_supply (J1.3), serial (U7.4)
NetP3_1: main (P3.1 U1.20), serial (U7.25)
NetP3_2: main (P3.2 U1.18), serial (U7.26)
NetQ1_1: main (U1.4), io_sensor (Q1.1)
NetQ2_1: main (U1.5), io_sensor (Q2.1)
NetR17_1: main (U1.9), power_supply (R17.1 R18.2)
NetR21_1: main (U1.6), io_sensor (R21.1)